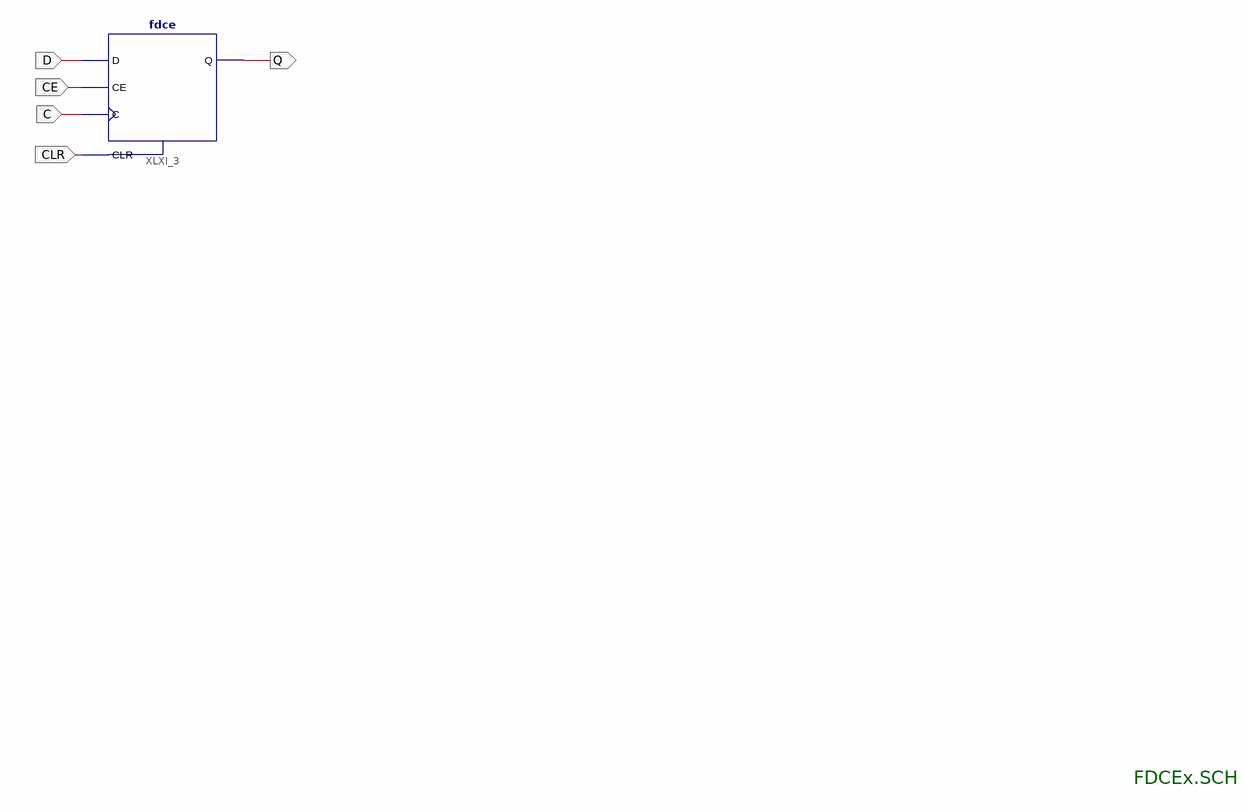
[diagram p0: schematic sheet 1]
// Xilinx ISE schematic FDCEx.sch (spartan3e) as structural Verilog: 1 symbols, 5 ports
module FDCEx (
  input  D,
  input  C,
  input  CLR,
  input  CE,
  output Q
);

  fdce XLXI_3 (.C(C), .CE(CE), .CLR(CLR), .D(D), .Q(Q));

  // Notes on the sheet:
  //   FDCEx.SCH
endmodule
